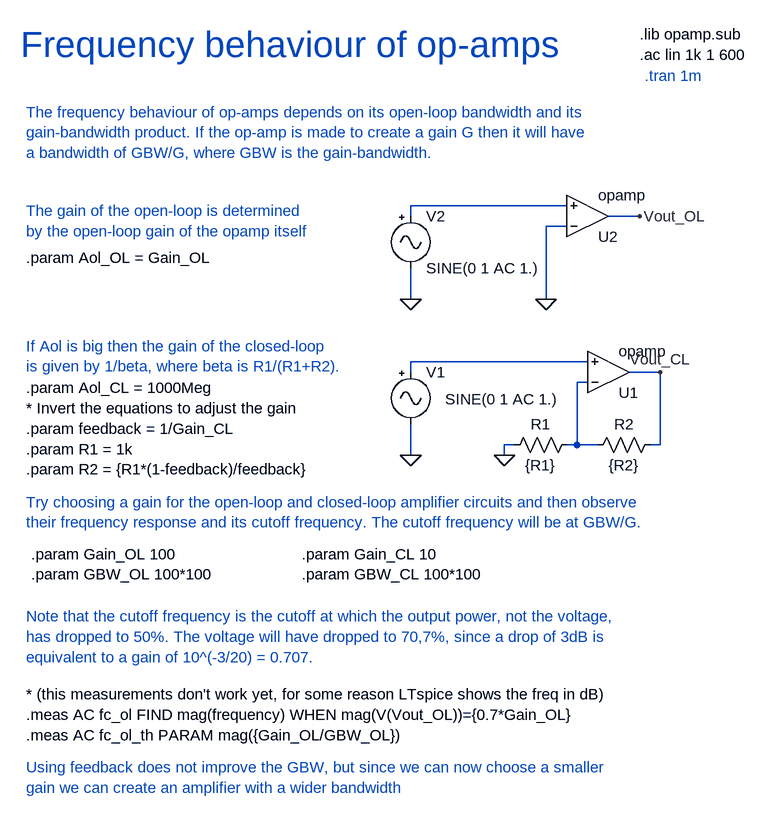
[diagram p0: schematic frequencybehaviour.asc]
frequencybehaviour.asc, the LTspice schematic file:
Version 4
SHEET 1 1216 1032
WIRE 896 96 656 96
WIRE 656 112 656 96
WIRE 1008 112 960 112
WIRE 896 128 864 128
WIRE 656 240 656 192
WIRE 864 240 864 128
WIRE 928 336 656 336
WIRE 656 352 656 336
WIRE 1040 352 992 352
WIRE 928 368 912 368
WIRE 816 464 800 464
WIRE 912 464 912 368
WIRE 912 464 896 464
WIRE 944 464 912 464
WIRE 1040 464 1040 352
WIRE 1040 464 1024 464
WIRE 656 480 656 432
WIRE 800 480 800 464
FLAG 800 480 0
FLAG 656 480 0
FLAG 656 240 0
FLAG 864 240 0
FLAG 1008 112 Vout_OL
FLAG 1040 352 Vout_CL
SYMBOL Opamps\\opamp 960 416 M180
SYMATTR InstName U1
SYMATTR SpiceLine Aol={Aol_CL}
SYMATTR SpiceLine2 GBW={GBW_CL}
SYMBOL res 912 448 R90
WINDOW 0 0 56 VBottom 2
WINDOW 3 32 56 VTop 2
SYMATTR InstName R1
SYMATTR Value {R1}
SYMBOL res 1040 448 R90
WINDOW 0 0 56 VBottom 2
WINDOW 3 32 56 VTop 2
SYMATTR InstName R2
SYMATTR Value {R2}
SYMBOL Opamps\\opamp 928 176 M180
SYMATTR InstName U2
SYMATTR SpiceLine Aol={Aol_OL}
SYMATTR SpiceLine2 GBW={GBW_OL}
SYMBOL Misc\\signal 656 336 R0
WINDOW 3 53 58 Left 2
WINDOW 123 0 0 Left 0
WINDOW 39 0 0 Left 0
SYMATTR Value SINE(0 1 AC 1.)
SYMATTR InstName V1
SYMBOL Misc\\signal 656 96 R0
WINDOW 123 0 0 Left 0
WINDOW 39 0 0 Left 0
SYMATTR InstName V2
SYMATTR Value SINE(0 1 AC 1.)
TEXT 1008 -168 Left 2 !.lib opamp.sub
TEXT 64 408 Left 2 !* Invert the equations to adjust the gain\n.param feedback = 1/Gain_CL\n.param R1 = 1k\n.param R2 = {R1*(1-feedback)/feedback}
TEXT 1016 -104 Left 2 ;.tran 1m
TEXT 1008 -136 Left 2 !.ac lin 1k 1 600
TEXT 56 -152 Left 5 ;Frequency behaviour of op-amps
TEXT 64 -48 Left 2 ;The frequency behaviour of op-amps depends on its open-loop bandwidth and its\ngain-bandwidth product. If the op-amp is made to create a gain G then it will have\na bandwidth of GBW/G, where GBW is the gain-bandwidth.
TEXT 64 176 Left 2 !.param Aol_OL = Gain_OL
TEXT 64 376 Left 2 !.param Aol_CL = 1000Meg
TEXT 72 632 Left 2 !.param Gain_OL 100\n.param GBW_OL 100*100
TEXT 64 552 Left 2 ;Try choosing a gain for the open-loop and closed-loop amplifier circuits and then observe\ntheir frequency response and its cutoff frequency. The cutoff frequency will be at GBW/G.
TEXT 64 104 Left 2 ;The gain of the open-loop is determined \nby the open-loop gain of the opamp itself
TEXT 64 312 Left 2 ;If Aol is big then the gain of the closed-loop\nis given by 1/beta, where beta is R1/(R1+R2).
TEXT 64 848 Left 2 !* (this measurements don't work yet, for some reason LTspice shows the freq in dB)\n.meas AC fc_ol FIND mag(frequency) WHEN mag(V(Vout_OL))={0.7*Gain_OL}\n.meas AC fc_ol_th PARAM mag({Gain_OL/GBW_OL})
TEXT 64 728 Left 2 ;Note that the cutoff frequency is the cutoff at which the output power, not the voltage,\nhas dropped to 50%. The voltage will have dropped to 70,7%, since a drop of 3dB is\nequivalent to a gain of 10^(-3/20) = 0.707.
TEXT 488 632 Left 2 !.param Gain_CL 10\n.param GBW_CL 100*100
TEXT 64 960 Left 2 ;Using feedback does not improve the GBW, but since we can now choose a smaller\ngain we can create an amplifier with a wider bandwidth

The netlist it stands for:
* frequencybehaviour.asc
XU1 N003 N002 Vout_CL opamp Aol={Aol_CL} GBW={GBW_CL}  ; pins invin noninvin out
R1 N003 0 {R1}
R2 Vout_CL N003 {R2}
XU2 0 N001 Vout_OL opamp Aol={Aol_OL} GBW={GBW_OL}  ; pins invin noninvin out
V1 N002 0 SINE(0 1 AC 1.)
V2 N001 0 SINE(0 1 AC 1.)
.lib opamp.sub
* Invert the equations to adjust the gain
.param feedback = 1/Gain_CL
.param R1 = 1k
.param R2 = {R1*(1-feedback)/feedback}
* .tran 1m
.ac lin 1k 1 600
* Frequency behaviour of op-amps
* The frequency behaviour of op-amps depends on its open-loop bandwidth and its
* gain-bandwidth product. If the op-amp is made to create a gain G then it will have
* a bandwidth of GBW/G, where GBW is the gain-bandwidth.
.param Aol_OL = Gain_OL
.param Aol_CL = 1000Meg
.param Gain_OL 100
.param GBW_OL 100*100
* Try choosing a gain for the open-loop and closed-loop amplifier circuits and then observe
* their frequency response and its cutoff frequency. The cutoff frequency will be at GBW/G.
* The gain of the open-loop is determined
* by the open-loop gain of the opamp itself
* If Aol is big then the gain of the closed-loop
* is given by 1/beta, where beta is R1/(R1+R2).
* (this measurements don't work yet, for some reason LTspice shows the freq in dB)
.meas AC fc_ol FIND mag(frequency) WHEN mag(V(Vout_OL))={0.7*Gain_OL}
.meas AC fc_ol_th PARAM mag({Gain_OL/GBW_OL})
* Note that the cutoff frequency is the cutoff at which the output power, not the voltage,
* has dropped to 50%. The voltage will have dropped to 70,7%, since a drop of 3dB is
* equivalent to a gain of 10^(-3/20) = 0.707.
.param Gain_CL 10
.param GBW_CL 100*100
* Using feedback does not improve the GBW, but since we can now choose a smaller
* gain we can create an amplifier with a wider bandwidth
.backanno
.end